# EAGLE board doska-digital (EAGLE 6.2)
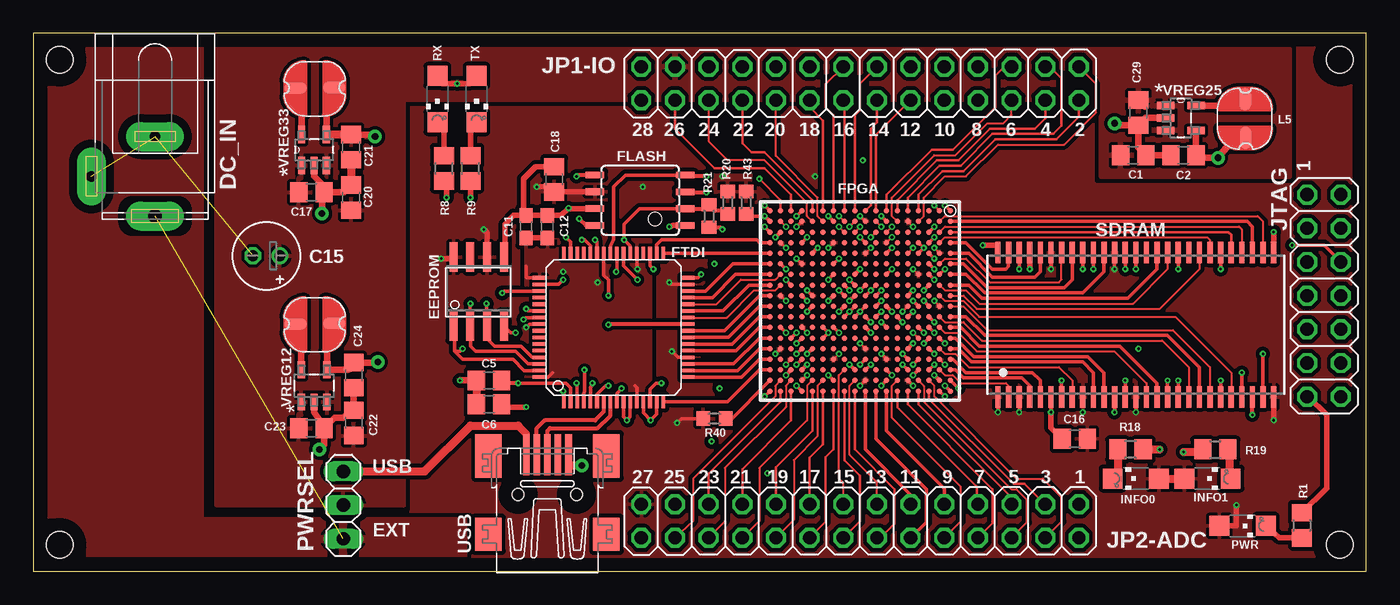
[diagram p5: board, top side]
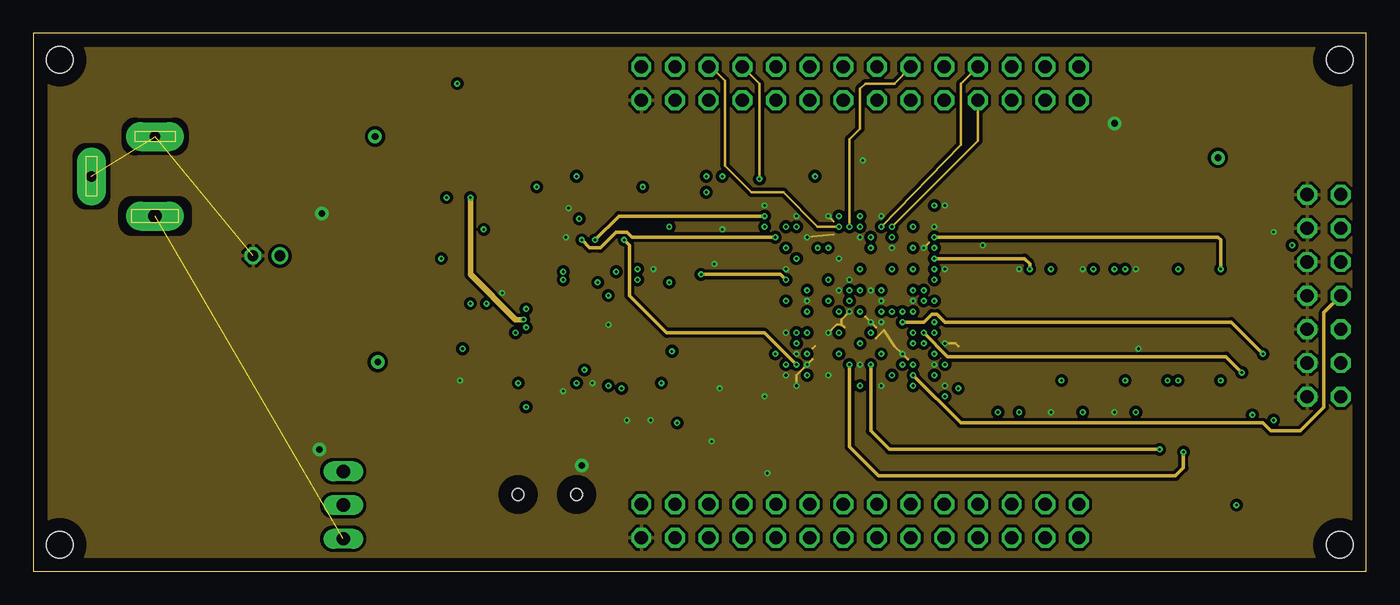
[diagram p6: board, inner layer Route2]
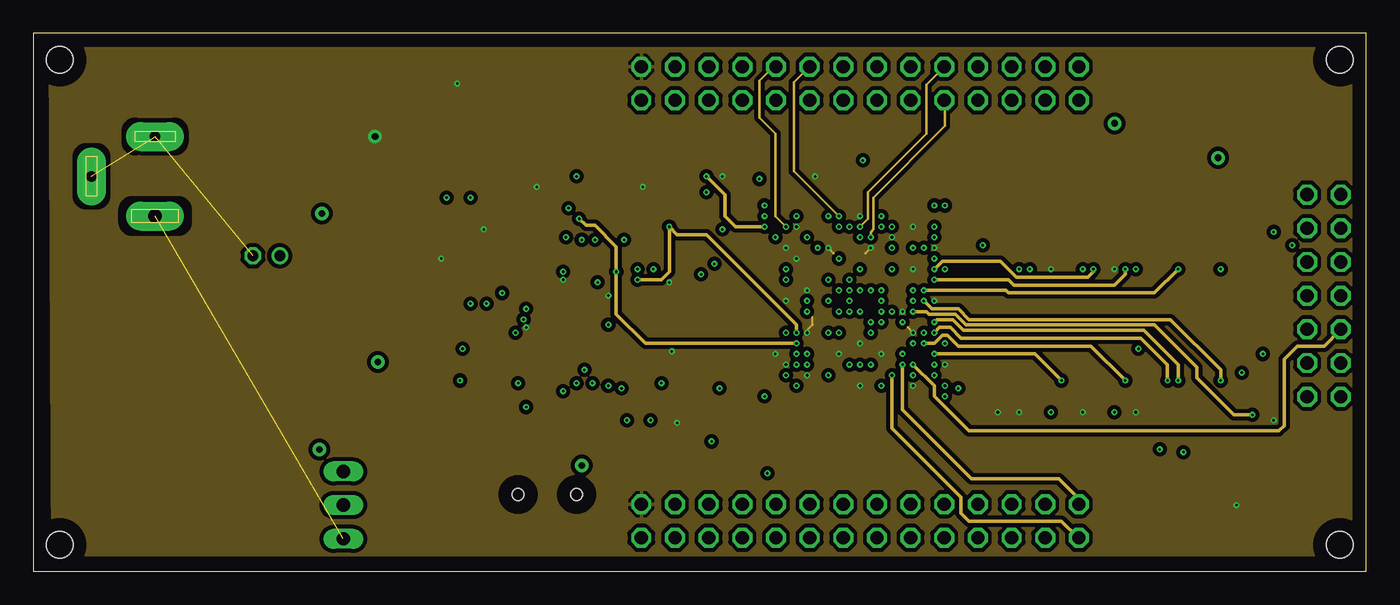
[diagram p7: board, inner layer Route15]
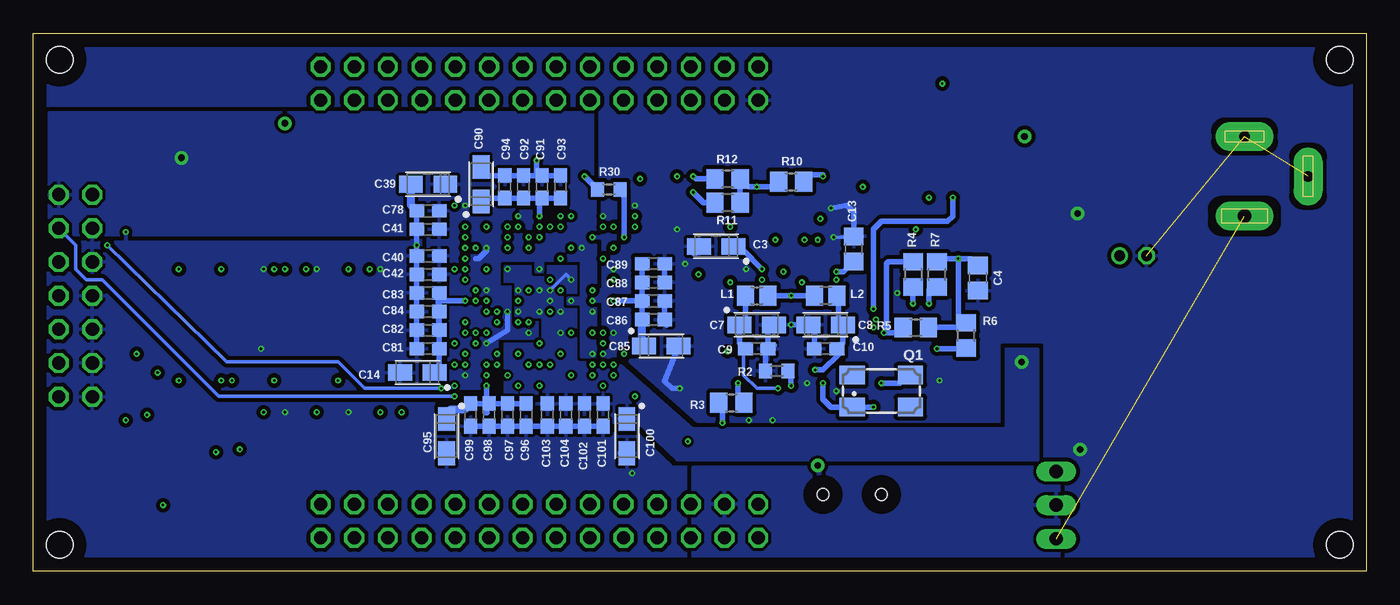
[diagram p8: board, bottom side, seen from below]

Size 100.6 x 40.6 mm. Coordinates in mm from the lower left corner, seen from the top.
Outline: 0,0 100.6,0 100.6,40.6 0,40.6 0,0
Copper layers (1*2+15*16): Top 0.035mm / dielectric 1.5mm / Route2 0.035mm / dielectric 0.15mm / Route15 0.035mm / dielectric 0.2mm / Bottom 0.035mm
Design rules: minimum track width 0.15mm, minimum drill 0.2mm, track to track 0.125mm, track to pad 0.125mm, pad to pad 0.125mm, via to via 0.125mm, smd to smd 0.1mm, copper to edge 40mil, drill to drill 0.08mm, minimum pad ring 0.125mm, minimum via ring 0.125mm, stop-mask expansion 4mil, vias tented up to drill 0.2mm, thermal gap 10mil
Holes 2 mm at 2,2 2,38.6 98.6,38.6 98.6,2

## Footprints (pad centres in the part's own frame; a part is rotated, then mirrored left to right if it is on the bottom)
C805 = smd 1.3 x 1.5: 1 -0.95,0; 2 0.95,0
CAPMP3216X180N = smd 1.8 x 1.25: + -1.3,0; - 1.3,0
C603 = smd 1.1 x 1: 1 -0.85,0; 2 0.85,0
RCL_E2-5 = drill 0.813 pad 1.27: + -1.016,0 | drill 0.813 pad 1.27 octagon: - 1.016,0
CON-JACK_SPC4078 = drill 0.8 pad 2.184 long: 1 -3,0; 2 0,-4.8 | drill 1 pad 2.184 long: 3 3,0
SOIC8 = smd 0.6 x 2.2: 1 -1.905,-2.6; 2 -0.635,-2.6; 3 0.635,-2.6; 4 1.905,-2.6; 5 1.905,2.6; 6 0.635,2.6; 7 -0.635,2.6; 8 -1.905,2.6
8S2 = smd 0.5 x 1.4: 1 -1.905,-3.404; 2 -0.645,-3.404; 3 0.625,-3.404; 4 1.895,-3.404; 5 1.905,3.404; 6 0.635,3.404; 7 -0.635,3.404; 8 -1.905,3.404
XILINX_DEVICES_CS324 = smd 0.4 x 0.4: A1 -6.8,6.8; A2 -6,6.8; A3 -5.2,6.8; A4 -4.4,6.8; A5 -3.6,6.8; A6 -2.8,6.8; A7 -2,6.8; A8 -1.2,6.8; A9 -0.4,6.8; A10 0.4,6.8; A11 1.2,6.8; A12 2,6.8; A13 2.8,6.8; A14 3.6,6.8; A15 4.4,6.8; A16 5.2,6.8; A17 6,6.8; A18 6.8,6.8; B1 -6.8,6; B2 -6,6; B3 -5.2,6; B4 -4.4,6; B5 -3.6,6; B6 -2.8,6; B7 -2,6; B8 -1.2,6; B9 -0.4,6; B10 0.4,6; B11 1.2,6; B12 2,6; B13 2.8,6; B14 3.6,6; B15 4.4,6; B16 5.2,6; B17 6,6; B18 6.8,6; C1 -6.8,5.2; C2 -6,5.2; C3 -5.2,5.2; C4 -4.4,5.2; C5 -3.6,5.2; C6 -2.8,5.2; C7 -2,5.2; C8 -1.2,5.2; C9 -0.4,5.2; C10 0.4,5.2; C11 1.2,5.2; C12 2,5.2; C13 2.8,5.2; C14 3.6,5.2; C15 4.4,5.2; C16 5.2,5.2; C17 6,5.2; C18 6.8,5.2; D1 -6.8,4.4; D2 -6,4.4; D3 -5.2,4.4; D4 -4.4,4.4; D5 -3.6,4.4; D6 -2.8,4.4; D7 -2,4.4; D8 -1.2,4.4; D9 -0.4,4.4; D10 0.4,4.4; D11 1.2,4.4; D12 2,4.4; D13 2.8,4.4; D14 3.6,4.4; D15 4.4,4.4; D16 5.2,4.4; D17 6,4.4; D18 6.8,4.4; E1 -6.8,3.6; E2 -6,3.6; E3 -5.2,3.6; E4 -4.4,3.6; E5 -3.6,3.6; E6 -2.8,3.6; E7 -2,3.6; E8 -1.2,3.6; E9 -0.4,3.6; E10 0.4,3.6; E11 1.2,3.6; E12 2,3.6; E13 2.8,3.6; E14 3.6,3.6; E15 4.4,3.6; E16 5.2,3.6; E17 6,3.6; E18 6.8,3.6; F1 -6.8,2.8; F2 -6,2.8; F3 -5.2,2.8; F4 -4.4,2.8; F5 -3.6,2.8; F6 -2.8,2.8; F7 -2,2.8; F8 -1.2,2.8; F9 -0.4,2.8; F10 0.4,2.8; F11 1.2,2.8; F12 2,2.8; F13 2.8,2.8; F14 3.6,2.8; F15 4.4,2.8; F16 5.2,2.8; F17 6,2.8; F18 6.8,2.8; G1 -6.8,2; G2 -6,2; G3 -5.2,2; G4 -4.4,2; G5 -3.6,2; G6 -2.8,2; G7 -2,2; G8 -1.2,2; G9 -0.4,2; G10 0.4,2; G11 1.2,2; G12 2,2; G13 2.8,2; G14 3.6,2; G15 4.4,2; G16 5.2,2; G17 6,2; G18 6.8,2; H1 -6.8,1.2; H2 -6,1.2; H3 -5.2,1.2; H4 -4.4,1.2; H5 -3.6,1.2; H6 -2.8,1.2; H7 -2,1.2; H8 -1.2,1.2; H9 -0.4,1.2; H10 0.4,1.2; H11 1.2,1.2; H12 2,1.2; H13 2.8,1.2; H14 3.6,1.2; H15 4.4,1.2; H16 5.2,1.2; H17 6,1.2; H18 6.8,1.2; J1 -6.8,0.4; J2 -6,0.4; J3 -5.2,0.4; J4 -4.4,0.4; J5 -3.6,0.4; J6 -2.8,0.4; J7 -2,0.4; J8 -1.2,0.4; J9 -0.4,0.4; J10 0.4,0.4; J11 1.2,0.4; J12 2,0.4; J13 2.8,0.4; J14 3.6,0.4; J15 4.4,0.4; J16 5.2,0.4; J17 6,0.4; J18 6.8,0.4; K1 -6.8,-0.4; K2 -6,-0.4; K3 -5.2,-0.4; K4 -4.4,-0.4; K5 -3.6,-0.4; K6 -2.8,-0.4; K7 -2,-0.4; K8 -1.2,-0.4; K9 -0.4,-0.4; K10 0.4,-0.4; K11 1.2,-0.4; K12 2,-0.4; K13 2.8,-0.4; K14 3.6,-0.4; K15 4.4,-0.4; K16 5.2,-0.4; K17 6,-0.4; K18 6.8,-0.4; L1 -6.8,-1.2; L2 -6,-1.2; L3 -5.2,-1.2; L4 -4.4,-1.2; L5 -3.6,-1.2; L6 -2.8,-1.2; L7 -2,-1.2; L8 -1.2,-1.2; L9 -0.4,-1.2; L10 0.4,-1.2; L11 1.2,-1.2; L12 2,-1.2; L13 2.8,-1.2; L14 3.6,-1.2; L15 4.4,-1.2; L16 5.2,-1.2; L17 6,-1.2; L18 6.8,-1.2; M1 -6.8,-2; M2 -6,-2; M3 -5.2,-2; M4 -4.4,-2; M5 -3.6,-2; M6 -2.8,-2; M7 -2,-2; M8 -1.2,-2; M9 -0.4,-2; M10 0.4,-2; M11 1.2,-2; M12 2,-2; M13 2.8,-2; M14 3.6,-2; M15 4.4,-2; M16 5.2,-2; M17 6,-2; M18 6.8,-2; N1 -6.8,-2.8; N2 -6,-2.8; N3 -5.2,-2.8; N4 -4.4,-2.8; N5 -3.6,-2.8; N6 -2.8,-2.8; N7 -2,-2.8; N8 -1.2,-2.8; N9 -0.4,-2.8; N10 0.4,-2.8; N11 1.2,-2.8; N12 2,-2.8; N13 2.8,-2.8; N14 3.6,-2.8; N15 4.4,-2.8; N16 5.2,-2.8; N17 6,-2.8; N18 6.8,-2.8; P1 -6.8,-3.6; P2 -6,-3.6; P3 -5.2,-3.6; P4 -4.4,-3.6; P5 -3.6,-3.6; P6 -2.8,-3.6; P7 -2,-3.6; P8 -1.2,-3.6; P9 -0.4,-3.6; P10 0.4,-3.6; P11 1.2,-3.6; P12 2,-3.6; P13 2.8,-3.6; P14 3.6,-3.6; P15 4.4,-3.6; P16 5.2,-3.6; P17 6,-3.6; P18 6.8,-3.6; R1 -6.8,-4.4; R2 -6,-4.4; R3 -5.2,-4.4; R4 -4.4,-4.4; R5 -3.6,-4.4; R6 -2.8,-4.4; R7 -2,-4.4; R8 -1.2,-4.4; R9 -0.4,-4.4; R10 0.4,-4.4; R11 1.2,-4.4; R12 2,-4.4; R13 2.8,-4.4; R14 3.6,-4.4; R15 4.4,-4.4; R16 5.2,-4.4; R17 6,-4.4; R18 6.8,-4.4; T1 -6.8,-5.2; T2 -6,-5.2; T3 -5.2,-5.2; T4 -4.4,-5.2; T5 -3.6,-5.2; T6 -2.8,-5.2; T7 -2,-5.2; T8 -1.2,-5.2; T9 -0.4,-5.2; T10 0.4,-5.2; T11 1.2,-5.2; T12 2,-5.2; T13 2.8,-5.2; T14 3.6,-5.2; T15 4.4,-5.2; T16 5.2,-5.2; T17 6,-5.2; T18 6.8,-5.2; U1 -6.8,-6; U2 -6,-6; U3 -5.2,-6; U4 -4.4,-6; U5 -3.6,-6; U6 -2.8,-6; U7 -2,-6; U8 -1.2,-6; U9 -0.4,-6; U10 0.4,-6; U11 1.2,-6; U12 2,-6; U13 2.8,-6; U14 3.6,-6; U15 4.4,-6; U16 5.2,-6; U17 6,-6; U18 6.8,-6; V1 -6.8,-6.8; V2 -6,-6.8; V3 -5.2,-6.8; V4 -4.4,-6.8; V5 -3.6,-6.8; V6 -2.8,-6.8; V7 -2,-6.8; V8 -1.2,-6.8; V9 -0.4,-6.8; V10 0.4,-6.8; V11 1.2,-6.8; V12 2,-6.8; V13 2.8,-6.8; V14 3.6,-6.8; V15 4.4,-6.8; V16 5.2,-6.8; V17 6,-6.8; V18 6.8,-6.8
LQFP64 = smd 1 x 0.27: 1 -5.6,3.75; 2 -5.6,3.25; 3 -5.6,2.75; 4 -5.6,2.25; 5 -5.6,1.75; 6 -5.6,1.25; 7 -5.6,0.75; 8 -5.6,0.25; 9 -5.6,-0.25; 10 -5.6,-0.75; 11 -5.6,-1.25; 12 -5.6,-1.75; 13 -5.6,-2.25; 14 -5.6,-2.75; 15 -5.6,-3.25; 16 -5.6,-3.75; 33 5.6,-3.75; 34 5.6,-3.25; 35 5.6,-2.75; 36 5.6,-2.25; 37 5.6,-1.75; 38 5.6,-1.25; 39 5.6,-0.75; 40 5.6,-0.25; 41 5.6,0.25; 42 5.6,0.75; 43 5.6,1.25; 44 5.6,1.75; 45 5.6,2.25; 46 5.6,2.75; 47 5.6,3.25; 48 5.6,3.75 | smd 0.27 x 1: 17 -3.75,-5.6; 18 -3.25,-5.6; 19 -2.75,-5.6; 20 -2.25,-5.6; 21 -1.75,-5.6; 22 -1.25,-5.6; 23 -0.75,-5.6; 24 -0.25,-5.6; 25 0.25,-5.6; 26 0.75,-5.6; 27 1.25,-5.6; 28 1.75,-5.6; 29 2.25,-5.6; 30 2.75,-5.6; 31 3.25,-5.6; 32 3.75,-5.6; 49 3.75,5.6; 50 3.25,5.6; 51 2.75,5.6; 52 2.25,5.6; 53 1.75,5.6; 54 1.25,5.6; 55 0.75,5.6; 56 0.25,5.6; 57 -0.25,5.6; 58 -0.75,5.6; 59 -1.25,5.6; 60 -1.75,5.6; 61 -2.25,5.6; 62 -2.75,5.6; 63 -3.25,5.6; 64 -3.75,5.6
CHIPLED_1206 = smd 1.5 x 1.5: A 0,-1.75; C 0,1.75
PINHEAD_2X14 = drill 1 octagon: 1 -16.51,-1.27; 2 -16.51,1.27; 3 -13.97,-1.27; 4 -13.97,1.27; 5 -11.43,-1.27; 6 -11.43,1.27; 7 -8.89,-1.27; 8 -8.89,1.27; 9 -6.35,-1.27; 10 -6.35,1.27; 11 -3.81,-1.27; 12 -3.81,1.27; 13 -1.27,-1.27; 14 -1.27,1.27; 15 1.27,-1.27; 16 1.27,1.27; 17 3.81,-1.27; 18 3.81,1.27; 19 6.35,-1.27; 20 6.35,1.27; 21 8.89,-1.27; 22 8.89,1.27; 23 11.43,-1.27; 24 11.43,1.27; 25 13.97,-1.27; 26 13.97,1.27; 27 16.51,-1.27; 28 16.51,1.27
PINHEAD_2X07 = drill 1 octagon: 1 -7.62,-1.27; 2 -7.62,1.27; 3 -5.08,-1.27; 4 -5.08,1.27; 5 -2.54,-1.27; 6 -2.54,1.27; 7 0,-1.27; 8 0,1.27; 9 2.54,-1.27; 10 2.54,1.27; 11 5.08,-1.27; 12 5.08,1.27; 13 7.62,-1.27; 14 7.62,1.27
FB805 = smd 1.3 x 1.5: 1 -0.85,0; 2 0.85,0
SMT43 = smd 0.813 x 1.676: P$1 -0.1,1.5; P$2 -0.05,-1.4
PINHEAD_1X03 = drill 1 long: 1 -2.54,0; 2 0,0; 3 2.54,0
CTS406 = smd 1.9 x 1.4: 1 -2.2,-1.2; 2 2.2,-1.2; 3 2.2,1.2; 4 -2.2,1.2
R805 = smd 1.3 x 1.5: 1 -0.95,0; 2 0.95,0
R603 = smd 1 x 1.1: 1 -0.85,0; 2 0.85,0
TSOP54 = smd 0.4 x 1.6: 1 -10.4,-5.45; 2 -9.6,-5.45; 3 -8.8,-5.45; 4 -8,-5.45; 5 -7.2,-5.45; 6 -6.4,-5.45; 7 -5.6,-5.45; 8 -4.8,-5.45; 9 -4,-5.45; 10 -3.2,-5.45; 11 -2.4,-5.45; 12 -1.6,-5.45; 13 -0.8,-5.45; 14 0,-5.45; 15 0.8,-5.45; 16 1.6,-5.45; 17 2.4,-5.45; 18 3.2,-5.45; 19 4,-5.45; 20 4.8,-5.45; 21 5.6,-5.45; 22 6.4,-5.45; 23 7.2,-5.45; 24 8,-5.45; 25 8.8,-5.45; 26 9.6,-5.45; 27 10.4,-5.45; 28 10.4,5.45; 29 9.6,5.45; 30 8.8,5.45; 31 8,5.45; 32 7.2,5.45; 33 6.4,5.45; 34 5.6,5.45; 35 4.8,5.45; 36 4,5.45; 37 3.2,5.45; 38 2.4,5.45; 39 1.6,5.45; 40 0.8,5.45; 41 0,5.45; 42 -0.8,5.45; 43 -1.6,5.45; 44 -2.4,5.45; 45 -3.2,5.45; 46 -4,5.45; 47 -4.8,5.45; 48 -5.6,5.45; 49 -6.4,5.45; 50 -7.2,5.45; 51 -8,5.45; 52 -8.8,5.45; 53 -9.6,5.45; 54 -10.4,5.45
32005-201 = smd 3.1 x 0.5: 1 3,1.6; 2 3,0.8; 3 3,0; 4 3,-0.8; 5 3,-1.6 | smd 2.5 x 2: M1 -3,-4.45; M2 -3,4.45 | smd 3.3 x 2: M3 2.9,4.45; M4 2.9,-4.45 | hole 0.9: 0,2.2; 0,-2.2
SOT95P284X122-5N = smd 1.27 x 0.559: 1 -1.219,0.965; 2 -1.219,0; 3 -1.219,-0.965; 4 1.219,-0.965; 5 1.219,0.965
SOT95P280X110-5N = smd 1.321 x 0.559: 1 -1.168,0.94; 2 -1.168,0; 3 -1.168,-0.94; 4 1.168,-0.94; 5 1.168,0.94

## Placement (x,y rotation side)
C1  10uF  [C805]  83,31.4 0 top
C2  10uF  [C805]  86.8,31.4 180 top
C3  3.3uF  [CAPMP3216X180N]  49.06,24.52 180 bottom
C4  0.1uF  [C805]  29.32,22.13 270 bottom
C5  27pF  [C805]  34.4,14.4 180 top
C6  27pF  [C805]  34.4,12.6 180 top
C7  4.7uF  [CAPMP3216X180N]  46,18.6 0 bottom
C8  4.7uF  [CAPMP3216X180N]  40.8,18.6 180 bottom
C9  0.1uF  [C603]  46,16.8 0 bottom
C10  0.1uF  [C603]  40.8,16.8 180 bottom
C11  0.1uF  [C603]  37.2,26 90 top
C12  0.1uF  [C603]  38.8,26 90 top
C13  0.1uF  [C805]  38.68,24.32 90 bottom
C14  10uF  [CAPMP3216X180N]  71.6,15 180 bottom
C15  47u  [RCL_E2-5]  17.6,23.8 180 top
C16  0.01uF  [C805]  78.6,10 180 top
C17  100n  [C805]  21,28.6 0 top
C18  0.1uF  [C805]  39.32,29.57 90 top
C20  10uF  [C805]  24,28.2 90 top
C21  22u  [C805]  24,32 270 top
C22  10uF  [C805]  24.2,11.2 90 top
C23  100n  [C805]  21,10.8 0 top
C24  10uF  [C805]  24.2,14.8 270 top
C29  100n  [C805]  83.4,34.6 270 top
C39  10uF  [CAPMP3216X180N]  70.8,29.2 180 bottom
C40  0.1uF  [C603]  70.8,23.8 180 bottom
C41  0.1uF  [C603]  70.8,25.8 180 bottom
C42  1000pF  [C603]  70.8,22.4 180 bottom
C78  0.1uF  [C603]  70.8,27.2 180 bottom
C81  0.1uF  [C603]  70.8,16.8 180 bottom
C82  0.1uF  [C603]  70.8,18.2 180 bottom
C83  1000pF  [C603]  70.8,21 180 bottom
C84  0.1uF  [C603]  70.8,19.6 180 bottom
C85  10uF  [CAPMP3216X180N]  53.2,17 0 bottom
C86  0.1uF  [C603]  53.8,19 0 bottom
C87  0.1uF  [C603]  53.8,20.4 0 bottom
C88  1000pF  [C603]  53.8,21.8 0 bottom
C89  0.1uF  [C603]  53.8,23.2 0 bottom
C90  10uF  [CAPMP3216X180N]  66.8,29.2 90 bottom
C91  0.1uF  [C603]  62.2,29 90 bottom
C92  0.1uF  [C603]  63.6,29 90 bottom
C93  1000pF  [C603]  60.8,29 90 bottom
C94  0.1uF  [C603]  65,29 90 bottom
C95  10uF  [CAPMP3216X180N]  69.4,10.2 270 bottom
C96  0.1uF  [C603]  63.4,11.8 270 bottom
C97  0.1uF  [C603]  64.8,11.8 270 bottom
C98  1000pF  [C603]  66.2,11.8 270 bottom
C99  0.1uF  [C603]  67.6,11.8 270 bottom
C100  10uF  [CAPMP3216X180N]  55.8,10.2 270 bottom
C101  0.1uF  [C603]  57.6,11.8 270 bottom
C102  0.1uF  [C603]  59,11.8 270 bottom
C103  1000pF  [C603]  61.8,11.8 270 bottom
C104  0.1uF  [C603]  60.4,11.8 270 bottom
DC_IN  [CON-JACK_SPC4078]  9.2,29.8 270 top
EEPROM  93LC46B  [SOIC8]  33.62,21.11 0 top
FLASH  AT45DB161D-SU  [8S2]  45.8,28 90 top
FPGA  XILINX_DEVICES_6SLX25CSG324  [XILINX_DEVICES_CS324]  62.4,20.4 270 top
FTDI  FT2232H  [LQFP64]  43.8,18.4 90 top
INFO0  0  [CHIPLED_1206]  83.2,7 90 top
INFO1  0  [CHIPLED_1206]  88.6,7 270 top
JP1-IO  [PINHEAD_2X14]  62.4,36.8 180 top
JP2-ADC  [PINHEAD_2X14]  62.4,3.8 180 top
JTAG  Xilinx_JTAG  [PINHEAD_2X07]  97.4,20.8 270 top
L1  Ferrite Bead  [FB805]  46,20.8 0 bottom
L2  Ferrite Bead  [FB805]  40.8,20.8 180 bottom
L3  4.7uH  [SMT43]  21.2,36.4 270 top
L4  4.7uH  [SMT43]  21.2,18.6 270 top
L5  4.7uH  [SMT43]  91.4,34.2 180 top
PWR  0  [CHIPLED_1206]  91.26,3.43 270 top
PWRSEL  [PINHEAD_1X03]  23.4,5 90 top
Q1  12MHz  [CTS406]  36.6,13.6 0 bottom
R1  470  [R805]  95.73,3.47 270 top
R2  12k 1%  [R603]  44.49,15.13 0 bottom
R3  10k  [R805]  47.91,12.73 0 bottom
R4  2.2k  [R805]  34.2,22.4 270 bottom
R5  10k  [R805]  34,18.4 0 bottom
R6  10k  [R805]  30.2,17.8 90 bottom
R7  10k  [R805]  32.4,22.4 90 bottom
R8  470  [R805]  31,30.4 90 top
R9  470  [R805]  33,30.4 90 top
R10  4.7k  [R805]  43.4,29.4 0 bottom
R11  4.7k  [R805]  48.2,27.8 180 bottom
R12  4.7k  [R805]  48.2,29.6 180 bottom
R18  470  [R805]  82.8,9.2 180 top
R19  470  [R805]  89.2,9.2 0 top
R20  4.7k  [R603]  52.4,27.8 270 top
R21  4.7k  [R603]  51,26.8 270 top
R30  4.7k  [R603]  57.16,28.82 0 bottom
R40  330  [R603]  51.41,11.53 0 top
R43  4.7k  [R603]  53.8,27.8 270 top
RX  0  [CHIPLED_1206]  30.51,35.64 180 top
SDRAM  IS42S16400F-7TLI  [TSOP54]  83.2,18.6 0 top
TX  0  [CHIPLED_1206]  33.46,35.64 180 top
USB  MINI-USB-32005-201  [32005-201]  38.8,5.8 90 top
VREG12  LM3671MF-1.2  [SOT95P284X122-5N]  21.2,14 90 top
VREG25  MCP1603T-250I/OS  [SOT95P280X110-5N]  86.6,34.2 0 top
VREG33  MCP1603T-330I/OS  [SOT95P280X110-5N]  21.2,31.8 90 top

## Tracks (layer width: path | path; a pad name or v marks a point on that pad's centre or on a via)
1.8V  (via drill 0.2)
  Top 0.254: FTDI.37 45.55,22.85 v45.6,22.8 | FTDI.64 38.85,14.65 39.2,15 | FTDI.12 45.55,13.85 45.4,14 | FTDI.49 37.25,22.15 37.2,22.2 37.2,23
  Top 0.406: C12.1 37.25,25.15 37.2,25.2
  Bottom 0.406: C13.1 39.45,22.6 v40,22.6 | C3.+ 47.12,24.32 v45.6,22.8
  other vias: 42.6,21.8
  pour Top (isolate 0.254): 37.2,25 46.6,25 46.6,13 37.2,13
3.3V  (via drill 0.2, 0.2 pad 0.2, 0.5 pad 1.02)
  Top 0.2: FPGA.E10 v65.6,19.6 | FPGA.D13 v66.4,18 | FPGA.B15 v68.8,15.6 | FPGA.D7 v66.4,22.8 | v68,20.4 FPGA.B10 | FPGA.B5 v68,24.4 | FPGA.T15 v56.8,15.6 | FPGA.R12 v58.4,18 | FPGA.J5 v63.2,24.4 | v60,24.4 FPGA.M4 | FPGA.E2 v66.4,26 | FPGA.G4 v64.8,25.2 | FPGA.J14 v62.4,17.2 | v60.8,16.4 FPGA.M15
  Top 0.254: FTDI.42 43.05,22.35 43.4,22 v43.4,20.8 | 38.75,21.65 FTDI.50 39.65,21.65 v40,22 | FPGA.U4 v56.8,24.4 | v58.4,21.2 FPGA.P9 | FPGA.J2 v62.4,26.8 | FPGA.J17 v62.4,14 | FPGA.R17 v58.4,14.8 | FPGA.U9 v56.8,20.4 | FTDI.31 48.15,21.65 v48,21.8 | FTDI.20 48.65,16.15 v48.2,16.6 | R40.1 48.93,11.53 v48.6,11.2 | FPGA.U14 v56,16.4 | C18.1 39.5,29 | FPGA.G15 v64,16.4 | FPGA.E17 v66.4,14 | SDRAM.43 v81.6,22.8 | 52.37,29.8 v52,29.8 | FPGA.R2 v57.6,26 | FPGA.R6 v57.6,23.6 | 34.2,23.66 EEPROM.6 | FTDI.56 37.45,18.65 v37.2,18.4
  Top 0.305: SDRAM.1 v72.8,12 | SDRAM.3 v74.4,12 | SDRAM.14 v83.2,12 | SDRAM.49 v76.8,22.8
  Top 0.406: PWR.A 90.8,3.43 v90.8,5 | FLASH.6 42.38,28.62 C18.1 | EEPROM.6 34.26,25.55 v34,25.8 | v30.8,23.6 31.61,23.6 EEPROM.8 | SDRAM.27 v93.6,11.4 | RX.A 30.91,36.8 v32,36.8 32.95,36.8 TX.A | 39.5,29 v38,29 | 22.15,35.95 L3.P$1 | 22.16,32.95 22.2,32.95 | 22.2,32.95 22.35,32.95 | 22.2,32.95 22.2,32.97 VREG33.4
  Top 0.506: C21.1 25.65,32.95 v25.8,32.8 | VREG33.4 22.15,35.95
  Top 0.61: INFO0.A INFO1.A | C21.1 22.35,32.95
  Route15 0.15: 58.8,18.6 58.8,19.2
  Route15 0.2: v66.4,18 66,18.4 | v58.4,18 58.4,18.2 58.8,18.6 | v63.2,24.4 FPGA.J5 | 60.4,24 v60,24.4
  Bottom 0.254: 48.6,12.47 R3.1
  Bottom 0.406: R30.1 58.51,29.31 v59,29.8 | R11.1 R12.1 46.6,29 v46,29 44.35,29 R10.1 | C87.1 v56.8,20.4 | 54.55,23.4 C89.1 C88.1 C87.1 | C86.1 C87.1 | 72.75,11.95 v72.8,12 | 66.4,12 v66.4,14 | C81.1 C82.1 | C82.1 70.05,20.55 70,20.6 69.8,20.4 v68,20.4 | C82.1 C84.1 C83.1 | C93.1 C91.1 | C91.1 C92.1 C94.1 66.6,28.15 C90.+ | L1.2 v43.4,20.8 L2.2 | 66.4,12 arc90 66.45,11.95 66.5,11.95 C98.1 | C81.1 arc-90 70.15,17.1 | C4.1 29.84,23.6 v30.8,23.6 | R7.2 31.95,23.6 v30.8,23.6 | R6.2 30.8,19.35 | 30.8,19.35 v30.8,23.6 | 30.8,19.35 30.8,18.4 R5.2 | 48.6,12.47 v48.6,11.2 | 66.35,11.95 66.4,12 | C96.1 C97.1 C98.1 | C98.1 C99.1 | C14.+ 69.95,15.4 C81.1 | C95.+ 69.25,12 | v62.4,26.8 62.4,27.95 C91.1
  Bottom 0.61: C85.+ 54.65,17 C86.1 | C99.1 68.05,12.2 69.05,12.2 arc-90 69.25,12
  other vias: 79.2,12
  pour Route15 (isolate 0.305): 1.2,39.6 1.4,1 1.6,1.2 100.2,1.2 100,1.4 100.2,39.8
  pour Top (isolate 0.305, rank 5): 0.4,40.4 100.4,40.4 100.4,39.8 100.4,0.2 0.2,0.2 0.2,40.4
5V
  Top 0.406: 23.27,5.27 PWRSEL.2
  Top 0.506: C29.1 83.9,35.05
  pour Bottom (isolate 0.254): 23.2,7.8 50.8,7.8 50.8,0.8 49.8,0.6 23.4,0.6 23.2,0.8
  pour Top (isolate 0.305): 17,39.4 90.8,39.4 90.8,35.6 22.2,35.6 22.2,31.8 17,31.8
  pour Top (isolate 0.254): 13.8,39.6 13.8,5 28,5 28,39.6
  pour Top (isolate 0.254): 80.6,39.4 80.6,29.8 94.8,29.8 94.8,39.4
!RESET  (via drill 0.2)
  Top 0.254: FTDI.14 46.55,13.75 47,14.2 v47.4,14.2
  Bottom 0.254: R3.2 47.16,12.96
  Bottom 0.406: 47.16,12.96 47.16,13.16 47.4,13.4 v47.4,14.2
+1.2V  (via drill 0.2, 0.2 pad 0.2, 0.5 pad 1.02)
  Top 0.254: FPGA.M12 v60.8,18 | FPGA.J8 v62.4,21.2 | FPGA.G7 v64.8,22.8 | FPGA.H11 v64,19.6 | FPGA.H9 v64,21.2 | FPGA.K11 v62.4,19.6 FPGA.J10 | FPGA.L8 v61.6,21.2 | FPGA.M7 v60,22
  Top 0.305: FPGA.L10 v60.8,19.6 | FPGA.K9 v61.6,20.4
  Top 0.506: L4.P$1 arc90 22.16,18.16 VREG12.4 23.67,15.22 arc90 C24.1 25.95,15.75 v26,15.8
  Bottom 0.254: v60,22 FPGA.M7 v61.6,21.2
  pour Bottom (isolate 0.2, rank 2): 59,23 65,23 65,11.4 62.6,11.4 62.4,11.2 55,11.2 52,8.4 24.8,8.4 24.8,16.8 27.2,16.8 27.2,10.8 50.8,10.8 59.2,18.2
+2.5V  (via drill 0.2, 0.2 pad 0.2, 0.5 pad 1.02)
  Top 0.2: FPGA.B1 v68,27.6 | FPGA.E5 v66.4,24.4
  Top 0.305: FPGA.P5 v59.2,24.4 | FPGA.P10 v58.4,19.6 | FPGA.P14 v58.4,16.4 | FPGA.M9 v60,20.4 | FPGA.K7 v62.4,22.8 | FPGA.E9 v66.4,21.2 | FPGA.G10 v64.8,19.6 | FPGA.J12 v63.2,18 | FPGA.E14 v66.4,17.2 | FPGA.B17 v68,14.8
  Top 0.506: L5.P$1 91.05,33.15 v89.4,31.2 87.95,31.2 C2.1 87.75,33 arc90 87.77,33.02 VREG25.4
  Bottom 0.406: 67.2,23.6 67,23.6 66.4,24.2 v66.4,24.4 | v64.8,19.6 64.8,18.2 v66.4,17.2
  pour Bottom (isolate 0.254, rank 3): 58.4,34.6 58.4,25.4 99.4,25.4 99.4,34.6
  pour Bottom (isolate 0.254): 58.2,24.6 58.2,16.2 59.2,16.2 59.2,24.6
  pour Bottom (isolate 0.254): 59,20.2 60.2,20.2 60.2,20.6 59,20.6
  pour Bottom (isolate 0.254): 62.2,23.6 62.2,22.6 62.6,22.6 62.6,23.6
  pour Bottom (isolate 0.2): 65.6,23.8 69.2,23.8 69.2,13.8 65.6,13.8
  pour Bottom (isolate 0.254): 66.6,21.4 66.6,18.2 64.6,18.2 64.6,21.4
  pour Bottom (isolate 0.254): 65.2,18.8 62.6,18.8 62.6,17.6 65.4,17.6 65.4,18.8
  pour Bottom (isolate 0.254, rank 3): 58.4,28.6 70.6,28.6 70.8,28.8 70.8,20.6 58.2,20.6 58.2,28.6
ABUS0
  Top 0.254: FTDI.16 52.4,12.8 54.8,15.2 FPGA.V16
ABUS1
  Top 0.254: FTDI.17 53.45,14.65 54.8,16 FPGA.V15
ABUS2
  Top 0.254: FTDI.18 53.15,15.15 54.8,16.8 FPGA.V14
ABUS3
  Top 0.254: FTDI.19 52.85,15.65 54.8,17.6 FPGA.V13
ABUS4
  Top 0.254: FTDI.21 53.05,16.65 54.8,18.4 FPGA.V12
ABUS5
  Top 0.254: FTDI.22 52.75,17.15 54.8,19.2 FPGA.V11
ABUS6
  Top 0.254: FTDI.23 52.45,17.65 54.8,20 FPGA.V10
ABUS7
  Top 0.254: FTDI.24 52.15,18.15 54.8,20.8 FPGA.V9
ABUS8
  Top 0.15: FTDI.26 52.35,19.15 54.4,21.2 56,21.2 FPGA.U8
ABUS9
  Top 0.254: FTDI.27 52.05,19.65 54,21.6 FPGA.V8
ABUS10
  Top 0.15: FTDI.28 51.55,20.15 53.4,22 56,22 FPGA.U7
ABUS11
  Top 0.254: FTDI.29 51.25,20.65 53,22.4 FPGA.V7
ABUS12
  Top 0.254: FTDI.30 50.75,21.15 52.8,23.2 FPGA.V6
ABUS13  (via drill 0.2)
  Top 0.254: FTDI.32 50.15,22.15 v50.4,22.4 | v56.8,22 FPGA.T8
  Route2 0.254: v50.4,22.4 56.4,22.4 v56.8,22
ABUS14
  Top 0.254: FPGA.V5 FTDI.33
ABUS15
  Top 0.254: FTDI.34 47.05,24.65 47.4,25 54.6,25 54.8,24.8 FPGA.V4
DM
  Top 0.305: USB.2 38,10.8 38.6,11.4 42.4,11.4 43.05,12.05 FTDI.7
DP
  Top 0.305: USB.3 38.8,10.6 39,10.8 42.6,10.8 43.55,11.75 FTDI.8
DQ0
  Top 0.15: FPGA.B16 68.8,14.8 69.4,14.8 70,14.2 73.4,14.2 73.6,14 SDRAM.2
DQ1
  Top 0.254: FPGA.A16 69.6,15.2 70.2,14.6 74.6,14.6 75.2,14 SDRAM.4
DQ2
  Top 0.254: FPGA.A15 69.4,16 70.4,15 75.4,15 76,14.4 SDRAM.5
DQ3  (via drill 0.2)
  Top 0.254: FPGA.C14 v68,16.4 | v77.6,14.4 SDRAM.7
  Route15 0.254: v68,16.4 75.6,16.4 v77.6,14.4
DQ4
  Top 0.15: FPGA.B14 68.8,16.4 69.6,16.4 70.6,15.4 77.4,15.4 78.4,14.4 SDRAM.8
DQ5
  Top 0.254: FPGA.A14 69.8,16.8 70.8,15.8 79.2,15.8 80,15 SDRAM.10
DQ6
  Top 0.254: SDRAM.11 80.8,15 79.6,16.2 71,16.2 69.6,17.6 FPGA.A13
DQ7  (via drill 0.2)
  Top 0.254: FPGA.C13 v67.2,17.2 | v82.4,14.4 SDRAM.13
  Route15 0.254: v82.4,14.4 79.8,17 69.8,17 69,17.8 68.6,17.8 68,17.2 v67.2,17.2
DQ8  (via drill 0.2)
  Top 0.254: FPGA.C7 v68,22 | v82.4,22.8 SDRAM.42
  Route15 0.254: v68,22 73.6,22 74,21.6 81.6,21.6 82.4,22.4 v82.4,22.8
DQ9
  Top 0.254: FPGA.A7 70.4,22.4 71.8,21 79.2,21 80.8,22.6 SDRAM.44
DQ10  (via drill 0.2)
  Top 0.254: FPGA.C6 v68,22.8 | v80,22.8 SDRAM.45
  Route15 0.254: v80,22.8 80,22.6 79.6,22.2 74.2,22.2 73,23.4 68.6,23.4 v68,22.8
DQ11
  Top 0.2: SDRAM.47 78.4,22.8
  Top 0.254: FPGA.A6 70.2,23.2 72,21.4 77.8,21.4 78.4,22 SDRAM.47
DQ12
  Top 0.15: FPGA.B6 68.8,23.6 70.4,23.6 72.2,21.8 77.4,21.8 77.6,22 SDRAM.48
DQ13
  Top 0.254: FPGA.A5 70.6,24 72.4,22.2 75.6,22.2 76,22.6 SDRAM.50
DQ14  (via drill 0.2)
  Top 0.254: FPGA.C5 v68,23.6
  Top 0.406: SDRAM.51 v75.2,22.8
  Route2 0.254: v68,23.6 74.8,23.6 75.2,23.2 v75.2,22.8
DQ15
  Top 0.254: FPGA.A4 70.4,24.8 72.4,22.8 73.4,22.8 73.6,23 SDRAM.53
EECLK  (via drill 0.2)
  Top 0.254: FTDI.62 37.35,15.65 36.4,16.6 33.4,16.6 33,17 33,18.5 EEPROM.2 32.98,20.18 v33,20.2
  Bottom 0.254: R7.1 33,21.2
  Bottom 0.406: 33,21.2 v33,20.2
EECS  (via drill 0.2)
  Top 0.254: FTDI.63 37.05,15.15 36.2,16 32.4,16 31.8,16.6 | 31.8,16.6 31.8,18.43 EEPROM.1 | 31.8,16.6 32.2,16.6 v32.4,16.8
  Bottom 0.254: 32.35,16.85 v32.4,16.8
  Bottom 0.406: R6.1 30.2,16.8 v32.4,16.8
EEDATA  (via drill 0.2)
  Top 0.254: FTDI.61 37.65,16.15 36.8,17 34.8,17 34.26,17.55 EEPROM.3 34.2,18.57 v34.2,20.2
  Bottom 0.406: v34.2,20.2 R4.2
GND  (via drill 0.2, 0.2 pad 0.2, 0.5 pad 1.02)  (2 unrouted)
  Top 0.2: v63.2,21.2 FPGA.H8 | USB.5 40.6,8
  Top 0.254: v35.4,21 35.55,21.15 FTDI.51 | 35.6,23.79 EEPROM.5 | C12.2 39.2,26.55 | FPGA.A1 v68.8,27.6 | FPGA.C3 v68,26 | FPGA.G2 v64,26.8 | FPGA.J4 v62.4,25.2 | FPGA.G5 v64.8,24.4 | FPGA.D5 v67.2,24.4 FPGA.D4 | FPGA.B7 v68.8,22.8 | FPGA.L11 v61.6,19.6 FPGA.K10 | v60.8,23.6 FPGA.M6 | v58.4,25.2 FPGA.R4 | v60,26.8 FPGA.M2 | FPGA.J11 v63.2,18.8 | FPGA.H10 v64,20.4 | FPGA.D10 v66.4,20.4 | FPGA.U12 v56.8,18 | FPGA.N12 v60,18 FPGA.N13 | FPGA.R14 v57.6,16.4 | FPGA.V18 v55.2,13.2 | v58.4,20.4 FPGA.R9 | v56.8,22.8 FPGA.U6 | FPGA.V1 v55.2,27.6 | FPGA.R18 v57.6,14 | FPGA.G17 v64,14 | v68.8,17.2 FPGA.B13 | v68,15.6 FPGA.C16 | FPGA.E15 v65.6,16.4 | FPGA.G12 v64,18.8 | FPGA.J15 v62.4,15.6 | v60,14.8 FPGA.M17 | v57.6,26.8 FPGA.R1 | SDRAM.52 v74.4,22.8 | SDRAM.46 v79.2,22.8 | SDRAM.41 v83.2,22.8 | FPGA.J9 v63.2,21.2 | FPGA.L9 v60.8,21.2 | FPGA.K8 v61.6,22 | FTDI.5 42.05,13.85 v42.2,14.2 | FTDI.11 45.05,11.65 v44.8,11.4 44.55,11.65 FTDI.10 | FTDI.15 47.05,11.85 v46.6,11.4 46.05,11.95 FTDI.13 | FTDI.35 46.55,23.05 v46.8,22.8 | FPGA.A18 v68.8,14 | FTDI.47 40.55,24.85 v40.2,25.2
  Top 0.305: SDRAM.12 v81.6,12 | R21.2 51.85,25.95 v52,25.8 | FPGA.T16 v56.8,14.8 | FPGA.R16 v58.4,15.6 | SDRAM.6 v76.8,12 | FTDI.1 40.05,13.55 v40,13.6 | FTDI.25 43.45,18.65 v43.4,18.6
  Top 0.406: C11.2 C12.2 39.85,26.85 v40.4,27.4 40.44,27.36 FLASH.7 | C11.2 37,27.15 37,29.6 37.92,30.52 C18.2 | 35.6,23.79 35.6,26.2 36.25,26.85 C11.2 | SDRAM.54 72.75,24 72.75,24.6 v71.65,24.6 | SDRAM.28 v93.6,25.6 | R1.1 97.6,6.29 97.6,11.8 96.22,13.18 JTAG.13 | C16.2 76.8,10.85 v76.8,12 | C5.2 32.8,14.4 32.22,14.4
  Top 0.506: 21.8,28.75 21.8,29.2 21.2,29.8 VREG33.2 | 21.8,28.75 C17.2 23.45,28.6 C20.2 | C29.2 83.85,34.1 arc-90 83.95,34.2 VREG25.2 | C2.2 C1.2 83.4,31.95 C29.2 | C24.2 C22.2 23.95,12.15 23.4,11.6 22.75,11.6 C23.2 | v32.2,14.4 32.8,14.4 | VREG12.2 21.2,12 21.6,11.4 21.6,11.15 C23.2 | C23.2 21.95,9.55 v21.6,9.2 | 21.8,28.75 v21.8,27 | C29.2 81.75,33.65 v81.6,33.8
  Top 0.61: C5.2 C6.2 | C21.2 C20.2 23.85,29 | 40.6,8 v41.4,8
  Route2 0.15: v60,26.8 FPGA.M2 | 60.4,25.4 v58.4,25.2 | v67.2,24.4 67.6,24.8 | 58.8,16.8 59,17 | 61,18.6 60.6,18.6 v60,18
  Route2 0.2: v68.8,17.2 69.6,17.2 69.8,17 | v57.6,14 57.6,14.8 v58.4,15.6 58.8,16 | 63.6,17.6 64.2,18.2 65,17 v65.6,16.4 FPGA.E15 | v61.6,19.6 61,19 61,18.6 61.2,18.4 | 63.6,18.4 FPGA.J11
  Bottom 0.254: v40.2,25.2 38.75,25.2 C13.2
  Bottom 0.406: 44.65,17.05 C9.2 | C87.2 C86.2 52.8,18.55 | C88.2 C89.2 | v51.8,13.8 52.4,13.8 52.95,14.35 C85.- | C101.2 C102.2 C104.2 C103.2 C96.2 C97.2 C98.2 C99.2 | 66.95,30.65 C90.- 66.6,29.85 C94.2 C92.2 C91.2 | C91.2 C93.2 | C78.2 C41.2 v71.65,24.6 C40.2 C42.2 C83.2 C84.2 C82.2 C81.2 arc90 71.85,17.1 | C9.2 45.44,16.61 | v40.4,27.4 39.2,27.6 38.68,27.08 C13.2 | C8.- 42.2,18.6 | 42.2,18.6 v43.4,18.6 | C3.- 50.68,23.92 | C91.2 62.6,30.05 v62.6,31 | R2.1 45.34,16.61 C9.2 | C10.2 41.65,18.05 42.2,18.6 | C9.2 45.15,18.25 44.8,18.6
  Bottom 0.61: C39.- 72.1,27.65 C78.2
  other vias: 51.2,9.8 51.4,23.2 55.4,7.4 83.4,16.8
  pour Route2 (isolate 0.254): 0.6,40 100.4,40 100.4,36 100.2,1 0.6,1
  pour Bottom (isolate 0.305, rank 5): 0.2,40.4 100.6,40.4 100.6,0 0,0 0,1 0.2,1
INIT_B  (via drill 0.2)
  Top 0.254: FTDI.44 42.05,24.55 41.6,25 v41.4,25
  Top 0.305: FPGA.U3 v56,25.2
  Route2 0.254: v56,25.2 45.2,25.2 44.8,25.6 44,25.6 42.8,24.4 42,24.4 v41.4,25
  Bottom 0.305: R30.2 56,28.82
  Bottom 0.406: v56,25.2 56,28.82
IOA0  (via drill 0.2)
  Top 0.254: FPGA.E16 v65.6,15.6
  Route15 0.254: v65.6,15.6 65.6,12.2 70.8,7 77.4,7 78.91,5.49 JP2-ADC.1
IOA1
  Top 0.2: FPGA.C18 67.6,13 74,6.6 74.8,6.6 76.33,5.07 JP2-ADC.3
IOA2
  Top 0.2: JP2-ADC.5 73.8,5.1 73.8,5.6 66.8,12.6 FPGA.D18
IOA3
  Top 0.2: JP2-ADC.7 71.2,5.16 71.2,6.4 65.2,12.4 FPGA.F18
IOA4
  Top 0.254: JP2-ADC.9 68.75,6.25 64.4,10.6 FPGA.G18
IOA5
  Top 0.254: JP2-ADC.11 66.21,5.79 62.8,9.2 FPGA.J18
IOA6
  Top 0.15: JP2-ADC.13 63.67,6.73 61.6,8.8 61.6,14 FPGA.K17
IOA7
  Top 0.15: JP2-ADC.15 61.13,6.67 60.8,7 60.8,14.8 FPGA.L16
IOA8
  Top 0.2: JP2-ADC.17 58.59,8.59 59.6,9.6 FPGA.N18
IOA9
  Top 0.2: JP2-ADC.19 56.05,7.85 58.8,10.6 FPGA.P18
IOA10
  Top 0.2: JP2-ADC.21 53.51,7.71 57.2,11.4 FPGA.T18
IOA11
  Top 0.2: FPGA.U18 56.4,12.8 50.97,7.37 JP2-ADC.23
IOA12  (via drill 0.2)
  Top 0.254: FPGA.G16 v64.8,14.8
  Route15 0.254: v64.8,14.8 64.8,10.8 70,5.6 70,4.4 70.6,3.8 77.6,3.8 78.87,2.53 JP2-ADC.2
IOA13
  Top 0.15: JP2-ADC.4 77.6,3.76 77.6,5.6 76.2,7 74.2,7 68,13.2 68,14 FPGA.C17
IOA14
  Top 0.15: JP2-ADC.6 75,3.7 75,5.4 74.2,6.2 73.8,6.2 67.2,12.8 67.2,14 FPGA.D17
IOA15
  Top 0.2: JP2-ADC.8 72.4,3.64 72.4,6.2 66,12.6 FPGA.E18
IOA16
  Top 0.15: JP2-ADC.10 70,3.78 70,6.4 64.8,11.6 64.8,14 FPGA.F17
IOA17
  Top 0.254: JP2-ADC.12 67.4,3.72 67.4,6.2 63.6,10 FPGA.H18
IOA18
  Top 0.2: FPGA.K18 62,9.2 65,6.2 65,3.6 63.93,2.53 JP2-ADC.14
IOA19
  Top 0.2: JP2-ADC.16 62.4,3.8 62.4,7.2 61.2,8.4 FPGA.L18
IOA20
  Top 0.2: JP2-ADC.18 59.8,3.74 59.8,8.6 60.4,9.2 FPGA.M18
IOA21
  Top 0.15: FPGA.N17 59.2,14 59.2,10.2 57.4,8.4 57.4,3.88 JP2-ADC.20
IOA22
  Top 0.15: FPGA.P17 58.4,14 58.4,11.4 54.8,7.8 54.8,3.8 54.78,3.8 JP2-ADC.22
IOA23
  Top 0.15: FPGA.T17 56.8,14 56.8,12.4 52.2,7.8 52.2,3.8 JP2-ADC.24
IOA24
  Top 0.15: FPGA.U17 56,14 56,13.2 49.8,7 49.8,3.8 JP2-ADC.26
IOB0
  Top 0.15: FPGA.D2 67.2,26.8 67.2,28.2 68.8,29.8 70.4,29.8 72.8,32.2 77.8,32.2 80.2,34.6 80.2,36.78 JP1-IO.1
IOB1
  Top 0.2: FPGA.E1 66,28.2 68.4,30.6 70,30.6 72.4,33 77,33 77.6,33.6 77.6,37.2 76.73,38.07 JP1-IO.3
IOB2
  Top 0.2: FPGA.G1 64.4,28.4 67.8,31.8 69.4,31.8 72.6,35 72.6,37.4 73.27,38.07 JP1-IO.5
IOB3  (via drill 0.2)
  Top 0.2: FPGA.H2 v64,26
  Route2 0.15: v64,26 70,32.2
  Route2 0.2: 70,32.2 70,36.78 JP1-IO.7
IOB4  (via drill 0.2)
  Top 0.2: FPGA.K3 v62.4,26
  Route15 0.2: v62.4,26 63,26.6 63,28.6 67.4,33 67.4,36.72 JP1-IO.9
IOB5  (via drill 0.2)
  Top 0.2: FPGA.K2 v61.6,26
  Route2 0.2: v61.6,26 61.6,32.6 62.4,33.4 62.4,36.4 62.8,36.8 65,36.8 66.21,38.01 JP1-IO.11
IOB6
  Top 0.2: FPGA.K1 62,34.4 62.4,34.8 62.4,36.8 JP1-IO.13
IOB7
  Top 0.2: FPGA.M1 60.4,34.4 59.8,35 59.8,36.74 JP1-IO.15
IOB8  (via drill 0.2)
  Top 0.2: FPGA.L2 v60.8,26.8
  Route15 0.2: JP1-IO.17 57.4,36.88 57.4,30.2 v60.8,26.8
IOB9  (via drill 0.2)
  Top 0.2: FPGA.U2 v56.8,26
  Route15 0.2: 56.13,38.07 JP1-IO.19 55.87,38.07 54.8,37 54.8,34.2 56,33 56,26.8 v56.8,26
IOB10  (via drill 0.2)
  Top 0.2: FPGA.U1 56.4,28 v54.8,29.6
  Route2 0.2: v54.8,29.6 54.8,36.78 JP1-IO.21
IOB11  (via drill 0.2)
  Top 0.2: FPGA.L3 v60.8,26
  Route2 0.2: v60.8,26 59.2,26 56.6,28.6 54.2,28.6 52.2,30.6 52.2,37 51.13,38.07 JP1-IO.23
IOB12
  Top 0.2: FPGA.D1 66.8,28.4 68.6,30.2 70.2,30.2 72.6,32.6 77.2,32.6 78.91,34.31 JP1-IO.2
IOB13
  Top 0.2: FPGA.F1 65.2,28 68.2,31 69.8,31 72.2,33.4 75.6,33.4 76.37,34.17 JP1-IO.4
IOB14
  Top 0.15: FPGA.F2 64.8,26.8 64.8,28.2 68,31.4 69.6,31.4 72,33.8 73.2,33.8 73.83,34.43 JP1-IO.6
IOB15  (via drill 0.2)
  Top 0.2: FPGA.G3 v64.8,26
  Route2 0.2: v64.8,26 71.29,32.49 JP1-IO.8
IOB16  (via drill 0.2)
  Top 0.2: FPGA.H3 v63.2,25.2
  Route15 0.2: 68.8,35.48 JP1-IO.10 arc-90 68.8,35.48 | 68.8,35.48 68.8,33.6 63.4,28.2 63.4,25.8 63.2,25.6 v63.2,25.2
IOB17
  Top 0.2: FPGA.H1 63.6,32.92 JP1-IO.12
IOB18
  Top 0.2: JP1-IO.14 63.67,33.87 63.2,33.4 63.2,27.6 FPGA.J1
IOB19
  Top 0.2: FPGA.L1 61.2,35.53 JP1-IO.16
IOB20
  Top 0.2: FPGA.N1 59.6,34 58.6,35 JP1-IO.18
IOB21
  Top 0.15: FPGA.N2 59.2,26.8 59.2,28.2 56.05,31.35 JP1-IO.20
IOB22
  Top 0.2: FPGA.P1 58.8,28 55.2,31.6 54.2,31.6 53.51,32.29 JP1-IO.22
IOB23
  Top 0.15: FPGA.P2 58.4,26.8 58.4,27.8 55.2,31 52.4,31 51,32.4 51,35.53 JP1-IO.24
IOB24
  Top 0.2: FPGA.T1 57.2,28.4 55.2,30.4 51.4,30.4 48.43,33.37 JP1-IO.26
LED_INFO0  (via drill 0.2)
  Top 0.254: FPGA.J16 v63.2,15.6
  Top 0.61: R18.1 v85,9.2
  Route2 0.254: v63.2,15.6 63.2,10.6 64.6,9.2 v85,9.2
LED_INFO1  (via drill 0.2)
  Top 0.254: 88.25,9 R19.1
  Top 0.305: FPGA.K16 v61.6,15.6
  Top 0.61: 88.25,9 v86.8,9
  Route2 0.254: v61.6,15.6 61.6,9.4 63.8,7.2 86.2,7.2 86.8,7.8 v86.8,9
N$1
  Top 0.406: PWR.C 94.02,2.52 R1.2
N$2
  Top 0.406: RX.C 31,33.9 R8.2
N$3
  Top 0.406: TX.C 33,33.93 R9.2
N$4  (via drill 0.2)
  Top 0.254: FTDI.6 42.55,13.35 43.2,14 v43.4,14
  Bottom 0.406: R2.2 43.4,15.19 v43.4,14
N$5  (via drill 0.2)
  Top 0.254: 42.29,29.8 FLASH.5
  Top 0.305: v41,29.8 41.1,29.91 FLASH.5
  Bottom 0.406: v41,29.8 41,29.91 FLASH.5 42.4,29.4 R10.2
N$7  (via drill 0.2)
  Top 0.254: 49.23,28.6 FLASH.3
  Top 0.305: 49.23,28.6 v50.8,28.6
  Bottom 0.406: R11.2 50,27.8 v50.8,28.6
N$9  (via drill 0.2)
  Top 0.254: FTDI.2 40.55,13.85 40.2,14.2 v36.6,14.2
  Top 0.305: v36.6,14.2 35.55,14.2 C5.1
  Bottom 0.406: Q1.3 35.2,14.2 v36.6,14.2
N$10  (via drill 0.2)
  Top 0.254: FTDI.3 41.05,14.15 arc90 v41,14.2
  Top 0.406: v37.2,12.4 35.55,12.4 C6.1
  Bottom 0.254: Q1.1 38.4,12.4
  Bottom 0.406: Q1.1 40.4,12.4 41,13 v41,14.2 | v37.2,12.4 38.4,12.4
N$11
  Top 0.506: VREG12.5 20.23,18.21 arc90 L4.P$2
N$12
  Top 0.406: 81.85,7.5 INFO0.C
  Top 0.61: R18.2 81.85,7.5
N$13
  Top 0.506: L5.P$2 90.9,35.05 arc90 90.81,35.14 VREG25.5
N$14
  Top 0.406: 37.2,10.4 USB.1
  Top 0.55: 36.6,11 37.2,10.4
  Top 0.61: PWRSEL.3 29.54,7.54 33,11 36.6,11
N$15
  Top 0.506: VREG33.5 20.26,36.45 L3.P$2
N$18  (1 unrouted)
  pour Top (isolate 0.61): 12.6,39.4 1.2,39.6 1.2,1.4 36.8,1.4 36.8,3.8 12.6,3.8
N$22
  Top 0.254: R19.2 90.25,9.1
  Top 0.61: 90.25,9.1 90.25,7.1 INFO1.C
N$25  (via drill 0.2)
  Top 0.254: FTDI.55 37.15,19.15 v37,19
  Top 0.406: R9.1 v33,28.2
  Route2 0.406: v37,19 36.4,19 33,22.4 v33,28.2
N$29  (via drill 0.2)
  Top 0.254: FTDI.54 37.35,19.65 v37.2,19.8 | R8.1 31.2,29.85
  Top 0.406: R8.1 31.2,29.25 v31.2,28.2
  Bottom 0.406: v37.2,19.8 37.2,25.8 36.6,26.4 31.6,26.4 31.2,26.8 v31.2,28.2
N$40
  Top 0.254: R40.2 52.53,11.33 FPGA.V17
N$43  (via drill 0.2)
  Top 0.254: FPGA.B18 v68.8,13.2
  Bottom 0.254: v68.8,13.2 86.6,13.2 95.4,22 96.6,22 97.4,22.8 97.4,24.61 JTAG.4
N$44  (via drill 0.2)
  Top 0.254: FPGA.A17 v69.8,13.8 | v95,24.6 97.41,24.6 JTAG.6
  Bottom 0.254: v69.8,13.8 75.6,13.8 77.6,15.8 86,15.8 v95,24.6
N$45  (via drill 0.2)
  Top 0.254: EEPROM.4 36.03,18 v36.4,18
  Bottom 0.254: R5.1 35.35,18
  Bottom 0.406: 35.35,18 v36.4,18 36.2,18.2 36.2,23.2 36.05,23.35 R4.1
N$46  (via drill 0.2)
  Top 0.254: FPGA.D16 v66.4,14.8
  Route2 0.254: 97.47,19.6 JTAG.8 97.4,19.53 97.4,12.4 95.6,10.6 93.4,10.6 92.8,11.2 70,11.2 v66.4,14.8
N$47  (via drill 0.2)
  Top 0.254: FPGA.D15 v66.4,15.6
  Route15 0.254: JTAG.10 97.41,17 95.4,17 94.4,16 94.4,11 94,10.6 70.6,10.6 68,13.2 68,14 v66.4,15.6
N$49  (via drill 0.2)
  Top 0.254: FTDI.9 44.05,13.45 v44.4,13.8
  Bottom 0.254: 46.9,20.35 L1.1 | v44.4,13.8 46,13.8 47,14.8 47,16.75 C9.1
  Bottom 0.406: 46.85,16.9 C9.1 47.3,17.25 C7.+ 46.85,19.05 L1.1
N$481  (via drill 0.2)
  Top 0.254: FTDI.4 41.55,13.35 41.6,13.6 v41.6,15.2
  Bottom 0.254: 39.9,17.15 C10.1
  Bottom 0.406: L2.1 39.85,20.5 39.85,18.9 C8.+ 39.5,17.25 C10.1 39.85,16.35 41,15.2 v41.6,15.2 41.2,15.2
PROGRAM_B  (via drill 0.2)
  Top 0.254: FTDI.43 42.55,24.85 v42.4,25 | 53.91,26.8 v55.2,26.8
  Top 0.305: FPGA.V2 v55.2,26.8 | 53.91,26.8 53.8,26.91 R43.2
  Route2 0.2: 55,26.8 v55.2,26.8
  Route2 0.254: v42.4,25 44.2,26.8 v55.2,26.8
RA0
  Top 0.15: FPGA.B9 68.8,20.4 70.2,20.4 71.4,19.2 86.2,19.2 90.4,15 SDRAM.23
RA1  (via drill 0.2)
  Top 0.254: FPGA.D12 v67.2,18 | v91.2,15 SDRAM.24
  Route2 0.254: v67.2,18 69,16.2 90,16.2 v91.2,15
RA2  (via drill 0.2)
  Top 0.254: FPGA.E11 v66.4,19.6
  Top 0.305: v92,11.8 SDRAM.25
  Route15 0.254: v66.4,19.6 67.4,19.6 67.6,19.4 69.6,19.4 70.4,18.6 84.6,18.6 87.8,15.4 87.8,14.6 90.6,11.8 v92,11.8
RA3  (via drill 0.2)
  Top 0.254: FPGA.F11 v65.6,18.8 | v92.8,16.4 SDRAM.26
  Route2 0.254: v65.6,18.8 67.2,18.8 67.8,19.4 68.2,19.4 68.8,18.8 90.4,18.8 v92.8,16.4
RA4
  Top 0.15: FPGA.B2 68.8,26.8 92.4,26.8 92.8,26.4 SDRAM.29
RA5
  Top 0.254: FPGA.A2 91.6,26.4 92,26 SDRAM.30
RA6
  Top 0.15: FPGA.B3 68.8,26 91,26 91.2,25.8 SDRAM.31
RA7
  Top 0.2: FPGA.A3 90.2,25.6 90.4,25.4 SDRAM.32
RA8  (via drill 0.2)
  Top 0.254: FPGA.C4 v68,25.2 | v89.6,22.8 SDRAM.33
  Route2 0.254: v68,25.2 89.4,25.2 89.6,25 v89.6,22.8
RA9
  Top 0.15: FPGA.B4 68.8,25.2 88.6,25.2 88.8,25 SDRAM.34
RA10  (via drill 0.2)
  Top 0.254: FPGA.C10 v67.2,20.4 | v89.6,14.4 SDRAM.22
  Route15 0.254: v67.2,20.4 67.8,19.8 69.8,19.8 70.6,19 85.8,19 89.6,15.2 v89.6,14.4
RA11
  Top 0.15: SDRAM.35 88,22.8 85,19.8 71.2,19.8 70.2,20.8 FPGA.A9
RA12
  Top 0.254: SDRAM.20 88,15.4 85.6,17.8 71.8,17.8 70.4,19.2 FPGA.A11
RA13
  Top 0.15: FPGA.A10 70.2,20 72,18.2 86,18.2 88.8,15.4 SDRAM.21
RAMCNT0
  Top 0.254: SDRAM.16 84.8,14.2 82,17 71.4,17 70,18.4 FPGA.A12
RAMCNT1  (via drill 0.2)
  Top 0.254: FPGA.C12 v68,18 | v85.6,14.4 SDRAM.17
  Route15 0.254: v68,18 68.4,18.4 69.2,18.4 70,17.6 83.6,17.6 85.6,15.6 v85.6,14.4
RAMCNT2  (via drill 0.2)
  Top 0.254: FPGA.C11 v68,18.8 | v86.4,14.4 SDRAM.18
  Route15 0.254: v68,18.8 68.2,19 69.4,19 70.2,18.2 83.8,18.2 86.4,15.6 v86.4,14.4
RAMCNT3
  Top 0.15: FPGA.B11 68.8,18.8 70.2,18.8 71.6,17.4 85.2,17.4 87.2,15.4 SDRAM.19
RAMCNT4  (via drill 0.2)
  Top 0.254: FPGA.C8 v67.2,21.2 | v86.4,22.8 SDRAM.37
  Route15 0.254: v67.2,21.2 73.4,21.2 73.6,21 84.6,21 v86.4,22.8
RAMCNT5
  Top 0.15: SDRAM.38 85.6,22.8 83,20.2 71.4,20.2 70.4,21.2 68.8,21.2 FPGA.B8
RAMCNT6
  Top 0.15: SDRAM.15 84,14.2 81.6,16.6 71.2,16.6 69.8,18 68.8,18 FPGA.B12
RAMCNT7
  Top 0.254: FPGA.A8 70.6,21.6 71.6,20.6 82.6,20.6 84.8,22.8 SDRAM.39
SPI0  (via drill 0.2)
  Top 0.254: FPGA.R15 v57.6,15.6 | FTDI.38 45.05,24.55 v44.6,25 44.6,26.2 45.76,27.36 FLASH.2 | 50.7,27.36 R21.1
  Top 0.305: FLASH.2 50.7,27.36 | R20.2 52.4,27.2 51.45,27.2 R21.1
  Route2 0.254: v57.6,15.6 55.2,18 47.8,18 45,20.8 45,24.6 v44.6,25
SPI1  (via drill 0.2)
  Top 0.254: v57.6,18 FPGA.T13 | FTDI.39 44.55,23.05 v45.6,22
  Top 0.406: FLASH.1 48.3,26.09 v48,26
  Route15 0.254: v57.6,18 57.6,18.6 50.8,25.4 48.6,25.4 v48,26 48,22.6 47.4,22 v45.6,22
SPI2  (via drill 0.2)
  Top 0.254: FPGA.R13 v57.6,17.2 | FTDI.40 44.05,22.65 v44,22.6
  Top 0.305: v41.2,26.6 41.7,26.09 FLASH.8
  Route15 0.254: v57.6,17.2 46.2,17.2 44,19.4 v44,22.6 44,24.49 FLASH.8 41.7,26.09 v41.2,26.6
SPI3  (via drill 0.2, 0.2 pad 0.2)
  Top 0.254: 49.31,29.8 FLASH.4 44.7,29.89 43.8,29 43.8,25 43.55,24.55 FTDI.41 | FPGA.V3 v55.2,26
  Top 0.305: v50.8,29.8 49.31,29.8
  Route15 0.254: v50.8,29.8 52.2,28.4 52.2,26.8 53,26 v55.2,26
  Bottom 0.406: R12.2 50.6,29.6 v50.8,29.8

## Text on the board
tNames: 28 | 26 | 24 | 22 | 20 | 18 | 16 | 14 | 12 | 10 | 8 | 6 | 4 | 2 | 1 | USB | 27 | 25 | 23 | 21 | 19 | 17 | 15 | 13 | 11 | 9 | 7 | 5 | 3 | 1 | EXT